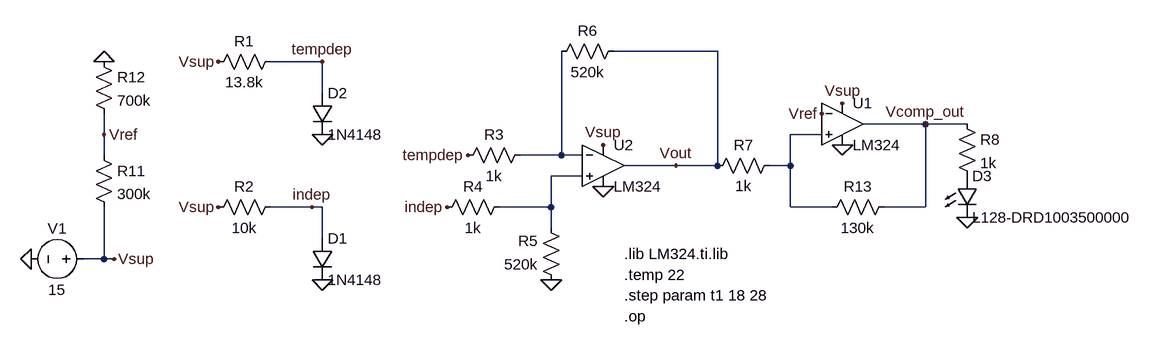
[diagram p0: schematic Lab1_alt.asc]
Lab1_alt.asc, the LTspice schematic file:
Version 4
SHEET 1 880 680
WIRE 128 -128 -32 -128
WIRE -480 -112 -560 -112
WIRE -480 -64 -480 -112
WIRE 448 -16 352 -16
WIRE 512 -16 448 -16
WIRE -816 0 -816 -32
WIRE 288 0 240 0
WIRE -816 32 -816 0
WIRE -112 32 -112 -128
WIRE -112 32 -176 32
WIRE -80 32 -112 32
WIRE 64 48 -16 48
WIRE 128 48 128 -128
WIRE 128 48 64 48
WIRE 240 48 240 0
WIRE 240 48 208 48
WIRE -80 64 -128 64
WIRE -496 112 -560 112
WIRE -480 112 -496 112
WIRE -128 112 -128 64
WIRE -128 112 -208 112
WIRE 240 112 240 48
WIRE 304 112 240 112
WIRE 448 112 448 -16
WIRE 448 112 384 112
WIRE -128 144 -128 112
WIRE -480 160 -480 112
WIRE -816 192 -816 112
WIRE -816 192 -848 192
WIRE -800 192 -816 192
FLAG -928 192 0
FLAG -48 16 Vsup
FLAG -480 0 0
FLAG -480 224 0
FLAG -480 -112 tempdep
FLAG -640 -112 Vsup
FLAG -496 112 indep
FLAG -128 224 0
FLAG -256 32 tempdep
FLAG -288 112 indep
FLAG -800 192 Vsup
FLAG -640 112 Vsup
FLAG 320 -48 Vsup
FLAG 320 16 0
FLAG 512 128 0
FLAG 288 -32 Vref
FLAG -816 -112 0
FLAG -816 0 Vref
FLAG -48 80 0
FLAG 64 48 Vout
FLAG 448 -16 Vcomp_out
SYMBOL voltage -832 192 R90
WINDOW 0 -32 56 VBottom 2
WINDOW 3 32 56 VTop 2
WINDOW 123 0 0 Left 0
WINDOW 39 0 0 Left 0
SYMATTR InstName V1
SYMATTR Value 15
SYMBOL OpAmps\\opamp2 -48 -16 R0
SYMATTR InstName U2
SYMATTR Value LM324
SYMBOL diode -496 160 R0
SYMATTR InstName D1
SYMATTR Value 1N4148
SYMBOL diode -496 -64 R0
SYMATTR InstName D2
SYMATTR Value 1N4148
SYMATTR Value2 temp={t1}
SYMBOL res -544 -128 R90
WINDOW 0 0 56 VBottom 2
WINDOW 3 32 56 VTop 2
SYMATTR InstName R1
SYMATTR Value 13.8k
SYMBOL res -544 96 R90
WINDOW 0 0 56 VBottom 2
WINDOW 3 32 56 VTop 2
SYMATTR InstName R2
SYMATTR Value 10k
SYMBOL res -160 16 R90
WINDOW 0 0 56 VBottom 2
WINDOW 3 32 56 VTop 2
SYMATTR InstName R3
SYMATTR Value 1k
SYMBOL res -192 96 R90
WINDOW 0 0 56 VBottom 2
WINDOW 3 32 56 VTop 2
SYMATTR InstName R4
SYMATTR Value 1k
SYMBOL res -112 240 R180
WINDOW 0 36 76 Left 2
WINDOW 3 36 40 Left 2
SYMATTR InstName R5
SYMATTR Value 520k
SYMBOL res -128 -112 R270
WINDOW 0 32 56 VTop 2
WINDOW 3 0 56 VBottom 2
SYMATTR InstName R6
SYMATTR Value 520k
SYMBOL OpAmps\\opamp2 320 -80 R0
SYMATTR InstName U1
SYMATTR Value LM324
SYMBOL res 224 32 R90
WINDOW 0 0 56 VBottom 2
WINDOW 3 32 56 VTop 2
SYMATTR InstName R7
SYMATTR Value 1k
SYMBOL LED 496 64 R0
SYMATTR InstName D3
SYMATTR Value L128-DRD1003500000
SYMBOL res 496 -32 R0
SYMATTR InstName R8
SYMATTR Value 1k
SYMBOL res -832 16 R0
SYMATTR InstName R11
SYMATTR Value 300k
SYMBOL res -832 -128 R0
SYMATTR InstName R12
SYMATTR Value 700k
SYMBOL res 400 96 R90
WINDOW 0 0 56 VBottom 2
WINDOW 3 32 56 VTop 2
SYMATTR InstName R13
SYMATTR Value 130k
TEXT -16 184 Left 2 !.lib LM324.ti.lib
TEXT -16 216 Left 2 !.temp 22
TEXT -16 248 Left 2 !.step param t1 18 28
TEXT -16 280 Left 2 !.op

The netlist it stands for:
* Lab1_alt.asc
V1 Vsup 0 15
XU2 N003 N002 Vsup 0 Vout LM324  ; pins In+ In- V+ V- OUT
D1 indep 0 1N4148
D2 tempdep 0 1N4148 temp={t1}
R1 tempdep Vsup 13.8k
R2 indep Vsup 10k
R3 N002 tempdep 1k
R4 N003 indep 1k
R5 0 N003 520k
R6 N002 Vout 520k
XU1 N001 Vref Vsup 0 Vcomp_out LM324  ; pins In+ In- V+ V- OUT
R7 N001 Vout 1k
D3 P001 0 L128-DRD1003500000
R8 Vcomp_out P001 1k
R11 Vref Vsup 300k
R12 0 Vref 700k
R13 Vcomp_out N001 130k
.model D D
.lib standard.dio
.lib LM324.ti.lib
.temp 22
.step param t1 18 28
.op
.backanno
.end

* Results of the author's LTspice run, read from the files saved beside the schematic
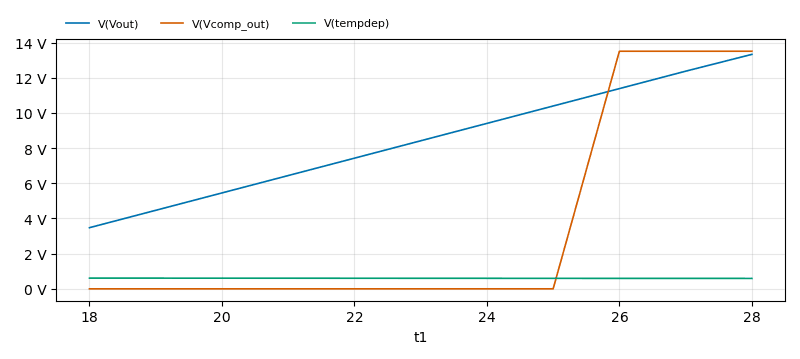
[diagram p1: Operating Point of Lab1_alt.asc, plotted from the saved traces]
* Operating Point, 1 run:
*   V(Vout): 3.472 V at t1=18 , 13.33 V at t1=28 , min 3.472 V, max 13.33 V
*   V(Vcomp_out): -5.622 mV at t1=18 , 13.5 V at t1=28 , min -5.622 mV, max 13.5 V
*   V(tempdep): 604.9 mV at t1=18 , 585.8 mV at t1=28 , min 585.8 mV, max 604.9 mV
* From the log:
*   Semiconductor Device Operating Points:
*                           --- Diodes ---
*   Name:    d:u2:c      d:u2:e      d:u2:lp     d:u2:ln     d:u2:p
*   Model:    u2:dx       u2:dx       u2:dx       u2:dx       u2:dx
*   Id:     -9.43e-12   -2.87e-12   -4.00e-11   -4.00e-11   -1.50e-11
*   Vd:     -9.43e+00   -2.87e+00   -4.00e+01   -4.00e+01   -1.50e+01
*   Req:     1.00e+12    1.00e+12    1.00e+12    1.00e+12    1.00e+12
*   CAP:     0.00e+00    0.00e+00    0.00e+00    0.00e+00    0.00e+00
*   Name:      d1          d2        d:u1:c      d:u1:e      d:u1:lp
*   Model:   1n4148      1n4148       u1:dx       u1:dx       u1:dx
*   Id:      1.44e-03    1.05e-03   -1.29e-11    8.07e-06   -4.00e-11
*   Vd:      6.11e-01    6.05e-01   -1.29e+01    6.06e-01   -4.00e+01
*   Req:     3.10e+01    4.19e+01    1.00e+12    3.15e+03    1.00e+12
*   CAP:     0.00e+00    0.00e+00    0.00e+00    0.00e+00    0.00e+00
*   Name:    d:u1:ln     d:u1:p            d3
*   Model:    u1:dx       u1:dx    l128-drd1003500000
*   Id:     -4.00e-11   -1.50e-11       -7.29e-15
*   Vd:     -4.00e+01   -1.50e+01       -5.62e-03
*   Req:     1.00e+12    1.00e+12        7.79e+11
*   CAP:     0.00e+00    0.00e+00        0.00e+00
*                           --- Bipolar Transistors ---
*   Name:     q:u2:1      q:u2:2      q:u1:1      q:u1:2
*   Model:     u2:qx       u2:qx       u1:qx       u1:qx
*   Ib:      -2.05e-08   -2.07e-08    1.69e-11   -4.07e-08
*   Ic:      -5.13e-06   -5.18e-06   -1.05e-11   -1.02e-05
*   Vbe:     -5.94e-01   -5.94e-01    6.41e+00   -6.12e-01
*   Vbc:      5.70e-01    5.69e-01    1.05e+01    3.36e+00
*   Vce:     -1.16e+00   -1.16e+00   -4.09e+00   -3.98e+00
*   BetaDC:   2.50e+02    2.50e+02   -6.21e-01    2.50e+02
*   Gm:       2.02e-04    2.04e-04    0.00e+00    4.00e-04
*   Rpi:      1.24e+06    1.23e+06    1.00e+12    6.25e+05
*   Rx:       0.00e+00    0.00e+00    0.00e+00    0.00e+00
*   Ro:       3.68e+23    3.57e+23    0.00e+00    1.94e+71
*   Cbe:      0.00e+00    0.00e+00    0.00e+00    0.00e+00
*   Cbc:      0.00e+00    0.00e+00    0.00e+00    0.00e+00
*   Cjs:      0.00e+00    0.00e+00    0.00e+00    0.00e+00
*   BetaAC:   2.50e+02    2.50e+02    0.00e+00    2.50e+02
*   Cbx:      0.00e+00    0.00e+00    0.00e+00    0.00e+00
*   Ft:       0.00e+00    0.00e+00    0.00e+00    0.00e+00